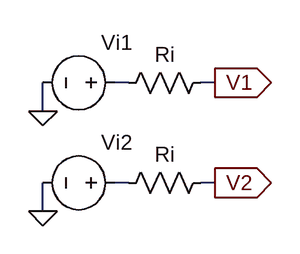
[diagram p0: schematic Señales.asc]
Señales.asc, the LTspice schematic file:
Version 4
SHEET 1 1560 680
WIRE -16 -64 -32 -64
WIRE 80 -64 64 -64
WIRE -112 -32 -112 -64
WIRE -16 48 -32 48
WIRE 80 48 64 48
WIRE -112 80 -112 48
FLAG -112 -32 0
FLAG 80 -64 V1
IOPIN 80 -64 Out
FLAG -112 80 0
FLAG 80 48 V2
IOPIN 80 48 Out
SYMBOL res -32 -48 R270
WINDOW 0 32 56 VTop 2
WINDOW 3 0 56 VBottom 2
SYMATTR InstName Ri
SYMATTR Value ""
SYMBOL voltage -16 -64 M270
WINDOW 0 45 31 VLeft 2
WINDOW 3 -29 -88 VLeft 2
WINDOW 123 0 0 Left 0
WINDOW 39 0 0 Left 0
SYMATTR InstName Vi1
SYMATTR Value ""
SYMBOL res -32 64 R270
WINDOW 0 32 56 VTop 2
WINDOW 3 0 56 VBottom 2
SYMATTR InstName Ri
SYMATTR Value ""
SYMBOL voltage -16 48 M270
WINDOW 0 45 31 VLeft 2
WINDOW 3 -30 -88 VLeft 2
WINDOW 123 0 0 Left 0
WINDOW 39 0 0 Left 0
SYMATTR InstName Vi2
SYMATTR Value ""

The netlist it stands for:
* Señales.asc
Ri N001 V1
Vi1 N001 0
Ri N002 V2
Vi2 N002 0
.backanno
.end